# Altium project PCB_Project.PrjPcb
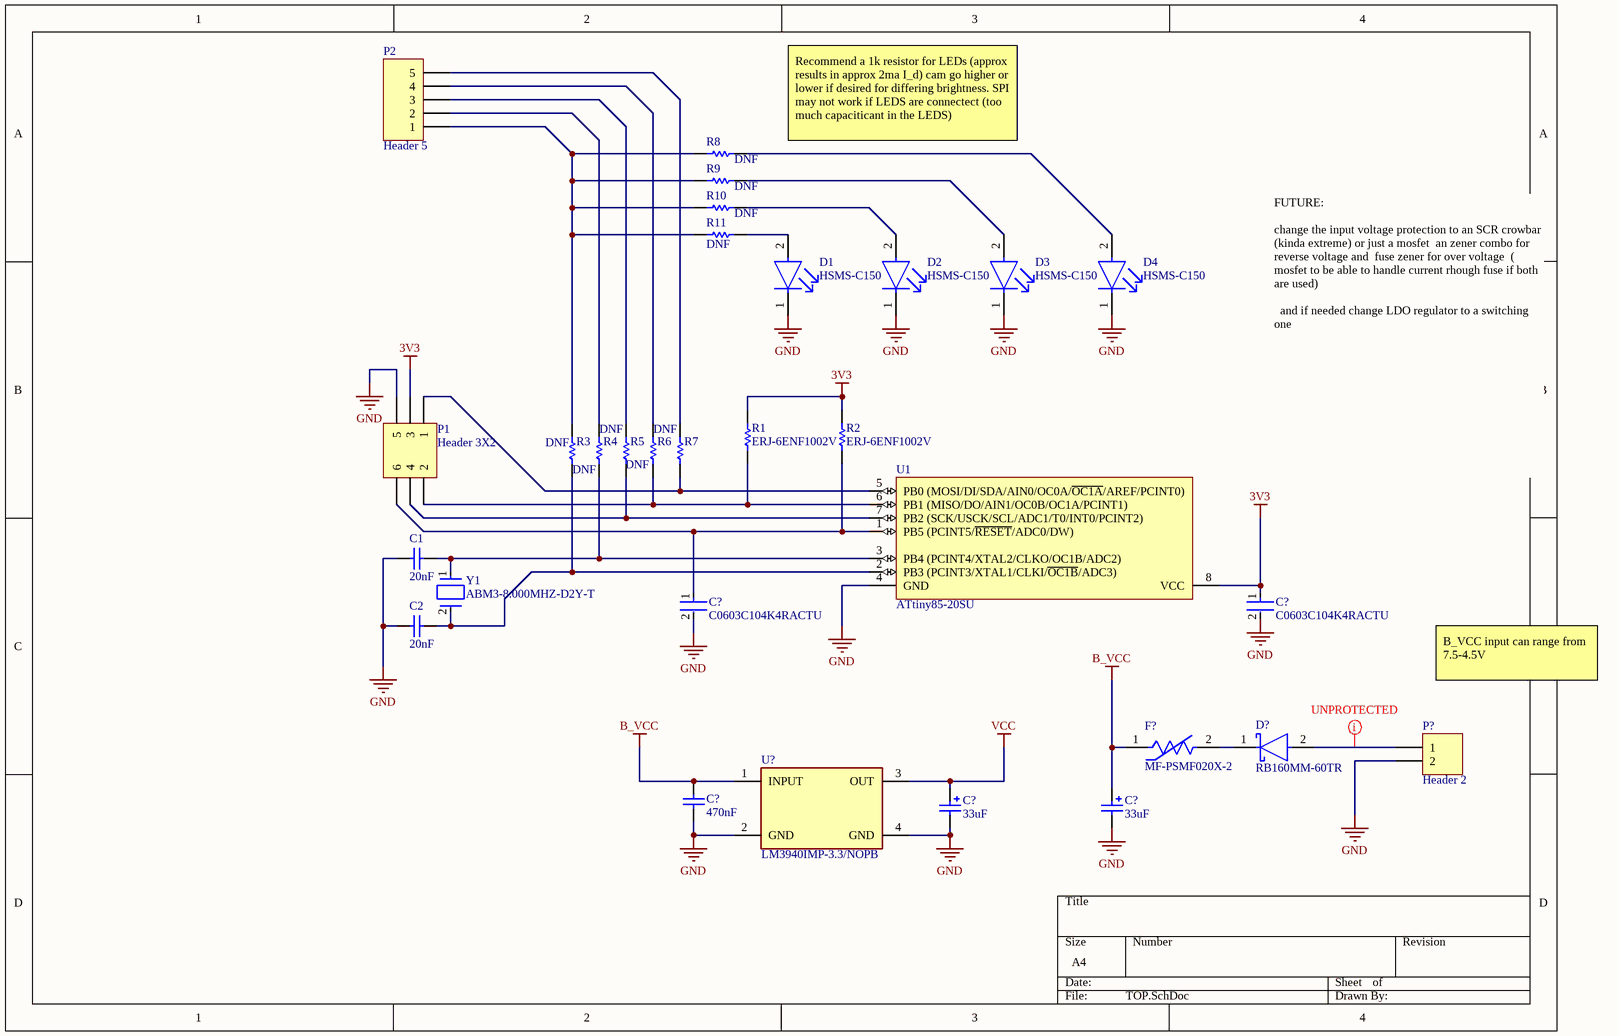
[diagram p0: TOP.SchDoc]
1 sheet, 30 parts. Net scope: global (net labels, ports and power ports of the same name join across sheets).

## Sheet TOP.SchDoc
size A4; SheetNumber: 1; SheetTotal: 1

### Parts
(Parts that share a designator on the sheet are numbered #1, #2 ... from top to bottom, then left to right.)
C1  20nF
C2  20nF
C?#1  C0603C104K4RACTU  [FP-C0603C-CF-MFG]
C?#2  C0603C104K4RACTU  [FP-C0603C-CF-MFG]
C?#3  33uF
C?#4  33uF
C?#5  470nF
D1  HSMS-C150  [FP-HSMS-C150-MFG]
D2  HSMS-C150  [FP-HSMS-C150-MFG]
D3  HSMS-C150  [FP-HSMS-C150-MFG]
D4  HSMS-C150  [FP-HSMS-C150-MFG]
D?  RB160MM-60TR  [FP-PMDU-MFG]
F?  MF-PSMF020X-2  [FP-MF-PSMF-MFG]
P1  Header 3X2  [HDR2X3]
P2  Header 5  [HDR1X5]
P?  Header 2  [HDR1X2]
R1  ERJ-6ENF1002V  [RESC2013X70X40LL20T20]
R2  ERJ-6ENF1002V  [RESC2013X70X40LL20T20]
R3  DNF  [RESC2013X70X40LL20T20]
R4  DNF  [RESC2013X70X40LL20T20]
R5  DNF  [RESC2013X70X40LL20T20]
R6  DNF  [RESC2013X70X40LL20T20]
R7  DNF  [RESC2013X70X40LL20T20]
R8  DNF  [RESC2013X70X40LL20T20]
R9  DNF  [RESC2013X70X40LL20T20]
R10  DNF  [RESC2013X70X40LL20T20]
R11  DNF  [RESC2013X70X40LL20T20]
U1  ATtiny85-20SU  [8S2_M]
U?  LM3940IMP-3.3/NOPB  [FP-DCY0004A-MFG]
Y1  ABM3-8.000MHZ-D2Y-T  [FP-ABM3-MFG]

### Nets
3V3: C?#2.1 P1.3 R1.2 R2.2 U1.8(VCC)
B_VCC: C?#4.1 C?#5.2 F?.1 U?.1(INPUT)
GND: C1.2 C2.2 C?#1.2 C?#2.2 C?#3.2 C?#4.2 C?#5.1 D1.1(C) D2.1(C) D3.1(C) D4.1(C) P1.5 P?.2 U1.4(GND) U?.2(GND) U?.4(GND)
VCC: C?#3.1 U?.3(OUT)
NetC1_1: C1.1 R4.1 U1.3(PB4_(PCINT4/XTAL2/CLKO/OC1B/ADC2)) Y1.1
NetC2_1: C2.1 R3.1 U1.2(PB3_(PCINT3/XTAL1/CLKI/~{OC1B}/ADC3)) Y1.2
NetC?#1_1: C?#1.1 P1.6 R2.1 U1.1(PB5_(PCINT5/~{RESET}/ADC0/DW))
NetD1_2: D1.2(A) R11.1
NetD2_2: D2.2(A) R10.1
NetD3_2: D3.2(A) R9.1
NetD4_2: D4.2(A) R8.1
NetD?_1: D?.1(C) F?.2
NetD?_2: D?.2(A) P?.1
NetP1_1: P1.1 R7.1 U1.5(PB0_(MOSI/DI/SDA/AIN0/OC0A/~{OC1A}/AREF/PCINT0))
NetP1_2: P1.2 R1.1 R6.1 U1.6(PB1_(MISO/DO/AIN1/OC0B/OC1A/PCINT1))
NetP1_4: P1.4 R5.1 U1.7(PB2_(SCK/USCK/SCL/ADC1/T0/INT0/PCINT2))
NetP2_1: P2.1 R3.2 R8.2 R9.2 R10.2 R11.2
NetP2_2: P2.2 R4.2
NetP2_3: P2.3 R5.2
NetP2_4: P2.4 R6.2
NetP2_5: P2.5 R7.2

### Layout directives
mark named UNPROTECTED: NetD?_2

### Notes on the sheet
- Recommend a 1k resistor for LEDs (approx results in approx 2ma I_d) cam go higher or lower if desired for differing brightness. SPI may not work if LEDS are connectect (too much capaciticant in the LEDS)
- FUTURE:
  change the input voltage protection to an SCR crowbar (kinda extreme) or just a mosfet  an zener combo for reverse voltage and  fuse zener for over voltage  ( mosfet to be able to handle current rhough fuse if both are used)
  and if needed change LDO regulator to a switching one
- B_VCC input can range from 7.5-4.5V

### Library data of the parts
C1 C2 = 20nF: Capacitor; Published: 8-Jun-2000; LatestRevisionDate: 17-Jul-2002; LatestRevisionNote: Re-released for DXP Platform.; PackageReference: RAD-0.3; Publisher: Altium Limited; PackageDescription: Radial Cap, Thru-Hole; 2 Leads; 0.3 in Pin Spacing
C?#1 C?#2 = CMP-2006-03811-3: Capacitor; Ceramic; Cap; .100uF; Tol 10%; SMT; Vol-Rtg 16V; X7R; Tape and Reel; Manufacturer: KEMET; Value: 0.10 μF; Temperature Coefficient: 30ppm/°C; Automotive Grade: Grade 1; Tolerance: 0.1; Description: C0603 0.10 μF X7R 30ppm/°C 10.00% 16 V; Digikey Description: Capacitor; Ceramic; Cap; .100uF; Tol 10%; SMT; Vol-Rtg 16V; X7R; Tape and Reel; Automotive: Yes; Temperature Range High: +125°C; Device Class L1: Passive Components; Material: Ceramic; Lead Free: Yes; Device Class L2: Capacitors; Capacitance: 0.10 μF; Height: 0.87mm; Voltage Rating: 16 V; Manufacturer Part Number: C0603C104K4RACTU; Octopart: https://octopart.com/c0603c104k4ractu-kemet-93067; Package: C0603C-CF; Temperature Characteristic: X7R; Device Class L3: Ceramic Capacitors; ComponentLink2URL: https://api.kemet.com/component-edge/download/datasheet/C0603C100J5GACAUTO.pdf; Temperature Range Low: -55°C; ComponentLink2Description: Datasheet; Mouser Description: Multilayer Ceramic Capacitors MLCC - SMD/SMT 16volts 0.1uF 10% X7R 10%; RoHS: TRUE; Temperature: -55°C to +125°C; Category: Cap
C?#3 C?#4 = 33uF: Polarized Capacitor; Published: 8-Jun-2000; LatestRevisionDate: 29-May-2009; LatestRevisionNote: IPC-7351 Footprint Added.; PackageReference: C0805; Publisher: Altium Limited; PackageDescription: Chip Capacitor
C?#5 = 470nF: Capacitor; Published: 8-Jun-2000; LatestRevisionDate: 17-Jul-2002; LatestRevisionNote: Re-released for DXP Platform.; PackageReference: RAD-0.3; Publisher: Altium Limited; PackageDescription: Radial Cap, Thru-Hole; 2 Leads; 0.3 in Pin Spacing
D1-D4 = CMP-21615-000001-1: LED RED DIFFUSED CHIP SMD; Luminous Intensity: 10mcd; Power Dissipation: 65mW; Viewing Angle: 170°; Number of Elements: 1; Forward Current: 20mA; Lens Color: White; Lens Style: Rectangular; Wavelength: 626nm; Forward Voltage: 2.1V; Reverse Voltage: 5V; Number of Pins: 2; Color: Red; Lead Free: Lead Free; Width: 1.6mm; Length: 3.2mm; REACH SVHC: No SVHC; Height: 1.1mm; Depth: 1.6mm; Power Rating: 65mW; Package Quantity: 1; Illumination Color: Red; Radiation Hardening: No; Case Code (Imperial): 1206; Max Operating Temperature: 85°C; Test Current: 20mA; Case/Package: 1206; Lens Transparency: Diffused; Number of LEDs: 1; Packaging: Tape and Reel; Mount: Surface Mount; Min Operating Temperature: -40°C; Case Code (Metric): 3216; Dominant Wavelength: 626nm
D? = CMP-08971-000007-1: DIODE SCHOTTKY 60V 1A PMDU; Manufacturer: Rohm; Max Surge Forward Current: 30A; Peak Reverse Current: 7uA; Max Junction Temp: +150°C; RoHS: TRUE; Reverse Voltage: 60V; Octopart: https://octopart.com/rb160mm-60tr-rohm-47137864; ComponentLink2URL: https://d1d2qsbl8m0m72.cloudfront.net/en/products/databook/datasheet/discrete/diode/schottky_barrier/rb160mm-60tr-e.pdf; ComponentLink2Description: Datasheet; Temperature: to +150°C; Max Repetitive Reverse Voltage: 60V; Manufacturer Part Number: RB160MM-60TR; Category: Diode; Forward Current: 1A; Lead Free: Yes; Mouser Description: RB160MM-60 Series 60 V 1 A Surface Mount Schottky Barrier Diode - PMDU; Device Class L3: Schottky Diodes; Automotive: No; Device Class L1: Discrete Semiconductors; Temperature Range High: +150°C; Package: PMDU; Device Class L2: Diodes; Digikey Description: DIODE SCHOTTKY 60V 1A PMDU; Height: 0.9mm
F? = CMP-07400-000005-1: PTC RESET FUSE 9V 200MA 0805; Manufacturer: Bourns; Description: Polymeric PTC Resettable Fuse 9V 200mA Ih Surface Mount 0805 (2012 Metric), Concave; Trip Current: 0.5A; Resistance: 0.65-3.5Ω; Current Rating: 40A; Value: 0.65-3.5Ω; Trip Time: 0.02s; Hold Current: 0.2A; ComponentLink2Description: Datasheet; Manufacturer Part Number: MF-PSMF020X-2; Height: 0.85mm; Ambient Temperature Range High: +85°C; Category: Fuse; Temperature Range Low: -40°C; ComponentLink2URL: https://www.bourns.com/docs/Product-Datasheets/mfpsmf.pdf; Temperature Range High: +85°C; RoHS: TRUE; Device Class L1: Circuit Protection; Device Class L3: unset; Package: MF-PSMF; Digikey Description: PTC RESET FUSE 9V 200MA 0805; Mouser Description: PTC Resettable Fuse 0.2A(hold) 0.5A(trip) 9V 40A 0.5W 0.02s 0.65Ohm SMD Solder Pad 0805 T/R; Voltage Rating: 9V; Automotive: No; Device Class L2: PTC Resettable Fuses; Temperature: -40°C to +85°C; Lead Free: Yes; Octopart: https://octopart.com/mf-psmf020x-2-bourns-7483437; Ambient Temperature Range Low: -40°C
P1 = Header 3X2: Header, 3-Pin, Dual row; LatestRevisionDate: 17-Jul-2002; LatestRevisionNote: Re-released for DXP Platform.; Publisher: Altium Limited
P2 = Header 5: Header, 5-Pin; LatestRevisionDate: 17-Jul-2002; LatestRevisionNote: Re-released for DXP Platform.; Publisher: Altium Limited
P? = Header 2: Header, 2-Pin; LatestRevisionDate: 17-Jul-2002; LatestRevisionNote: Re-released for DXP Platform.; Publisher: Altium Limited
R1 R2 = CMP-2001-04376-1: Manufacturer: Panasonic; Part Number: ERJ-6ENF1002V
R3-R11 = CMP-2001-04376-1: Manufacturer: Panasonic; Part Number: ERJ-6ENF1002V
U1 = CMP-0093-00173-2: 8-bit AVR Microcontroller, 20MHz, 2.7-5.5V, 8K Flash, 512 Bytes EEPROM, 512 Bytes SRAM, Industrial Grade (-40°C to 85°C), 8-Lead SOIC, Pb-Free; ComponentLink3Description: ATtiny25/45/85 Summary; DatasheetVersion: revN, Apr-2011; PackageVersion: revF, Apr-2008; ComponentLink3URL: http://www.atmel.com/dyn/resources/prod_documents/2586S.pdf; ComponentLink1URL: http://www.atmel.com/; ComponentLink2Description: ATtiny25/45/85 Datasheet; RevisionNote: DatasheetVersion updated. URLs added.; PackageDescription: 8-Lead, 0.208" Body, Plastic Small Outline Package (EIAJ); ComponentLink1Description: Manufacturer URL; PackageReference: 8S2; ComponentLink2URL: http://www.atmel.com/dyn/resources/prod_documents/doc2586.pdf
U? = CMP-0062-01788-4: IC REG LINEAR 3.3V 1A SOT223-4; Min Input Voltage: 4.5V; Max Supply Voltage: 7.5V; Number of Outputs: 1; Output Type: Fixed; Polarity: Positive; Dropout Voltage: 500mV; Quiescent Current: 15mA; Max Output Voltage: 3.3V; Length: 6.5mm; Termination: SMD/SMT; Width: 3.56mm; Min Supply Voltage: 4.5V; Max Output Current: 1A; Case/Package: SOT-223; Output Voltage: 3.3V; Current Rating: 1A; Packaging: Tape and Reel; Lead Free: Lead Free; Nominal Output Voltage: 3.3V; Height: 1.6mm; Series: -; Output Configuration: Positive; Radiation Hardening: No; Number of Regulators: 1; Package Quantity: 1000; REACH SVHC: No SVHC; Max Input Voltage: 7.5V; Max Operating Temperature: 125°C; Min Operating Temperature: -40°C; Output Current: 1A; Contact Plating: Tin; Number of Pins: 4; Mount: Surface Mount
Y1 = CMP-2000-05033-2: Crystal 8MHz ±20ppm 18pF SMD-2 5mm x 3.2mm; Series Resistance: 500R; Frequency Stability: 30ppm; ESR (Equivalent Series Resistance): 140R; Load Capacitance: 18pF; Height: 0.051inch; Tolerance: 20ppm; Depth: 3.2mm; Max Operating Temperature: 85°C; Frequency: 8MHz; Termination: SMD/SMT; Lead Free: Lead Free; Number of Pins: 2; Width: 3.2mm; RoHS Compliant: Yes; Resistor Type: Ceramic; Length: 5mm; Mount: Surface Mount; Case/Package: CSMD; Package Quantity: 1000; Radiation Hardening: No; Min Operating Temperature: -40°C; Packaging: Tape and Reel; Frequency Tolerance: 20ppm

## Assembly variants
Production: not fitted C? R3 R4 R5 R6 R7 R? R? R? R?